# EasyEDA Pro project 51单片机串口开关V4.eprj

# Schematic Schematic1
Create Date: 2023-08-01; Page Name: P1; Project Name: 51单片机串口开关V4; Schematic Name: Schematic1; Update Date: 2024-06-24; Company: 嘉立创EDA; Page Size: A4; Version: V1.0
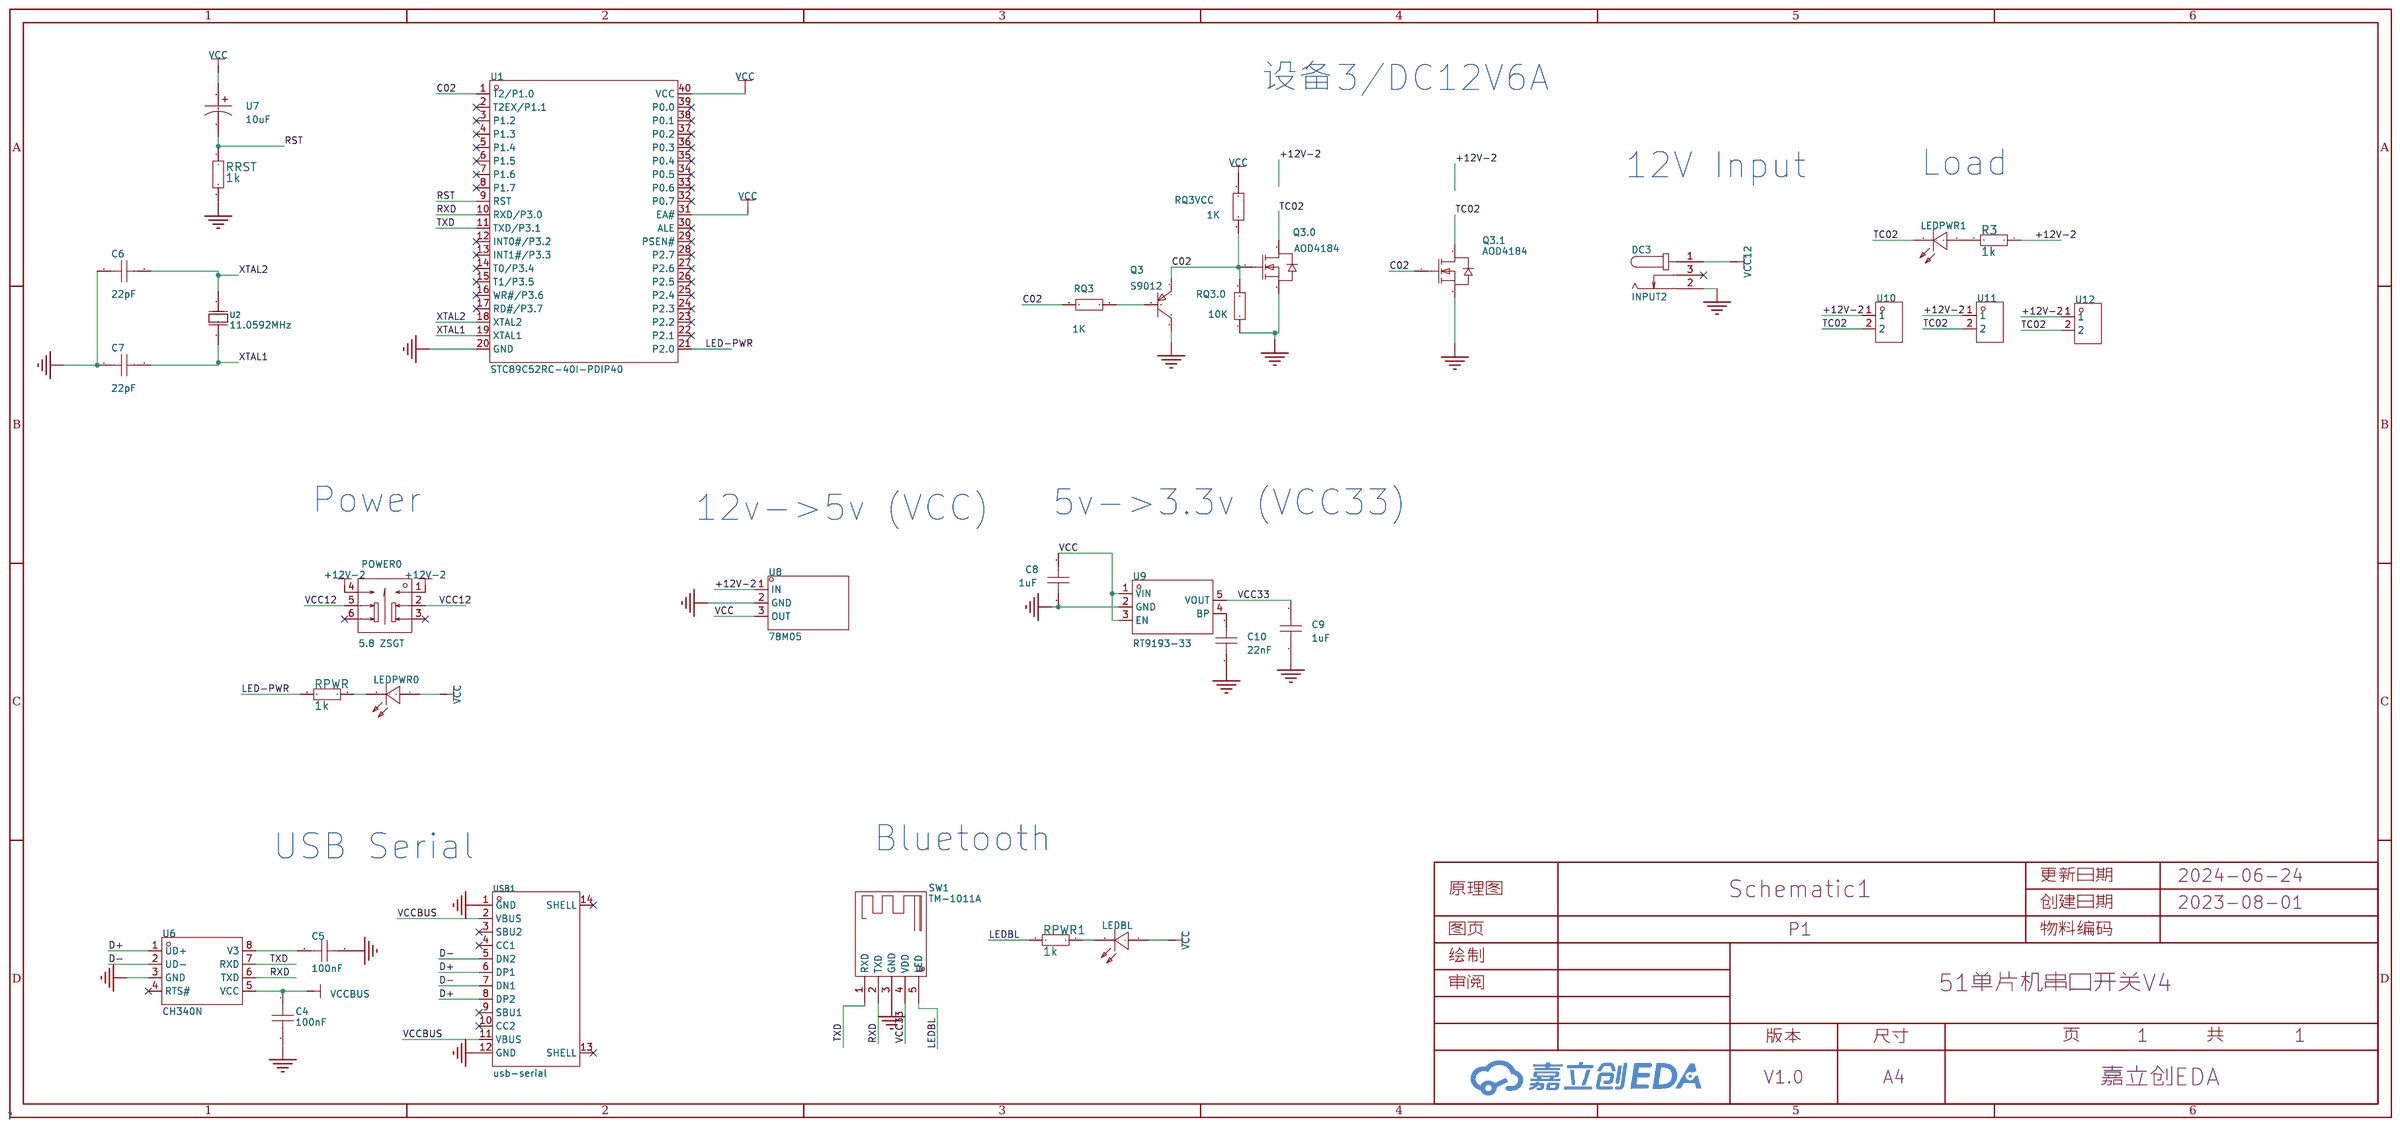
[diagram p0: schematic sheet]

## Parts
C4  100nF  [C0603]
C5  100nF  [C0603]
C6  22pF  [CAP-TH_L5.8-W2.4-P2.54-D0.6]
C7  22pF  [CAP-TH_L5.8-W2.4-P2.54-D0.6]
C8  1uF  [C0603]
C9  1uF  [C0603]
C10  22nF  [C0603]
DC3  INPUT2  [DC-IN-TH_DC-005-20A]
LEDBL  Φ3mm直插蓝色发光二极管  [LED-TH_BD4.1-P2.50-D0.5-FD_BULE]
LEDPWR0  Φ3mm直插蓝色发光二极管  [LED-TH_BD4.1-P2.50-D0.5-FD_BULE]
LEDPWR1  Φ3mm直插蓝色发光二极管  [LED-TH_BD4.1-P2.50-D0.5-FD_BULE]
POWER0  5.8 ZSGT  [SW-TH_5.8ZSGT]
Q3  S9012  [TO-92-3_L4.6-W3.6-P1.27-L-1]
Q3.0  AOD4184  [TO-252-2_L6.6-W6.1-P4.58-LS9.9-BR]
Q3.1  AOD4184  [TO-252-2_L6.6-W6.1-P4.58-LS9.9-BR]
R3  1k  [0603]
RPWR  1k  [0603]
RPWR1  1k  [0603]
RQ3  1K  [R0603]
RQ3.0  10K  [R0603]
RQ3VCC  1K  [R0603]
RRST  1k  [0603]
SW1  TM-1011A  [SW-SMD_TM-1011A]
U1  STC89C52RC-40I-PDIP40  [DIP-40_L52.0-W13.7-P2.54-LS15.2-BL]
U2  11.0592MHz  [CRYSTAL-TH_L10.8-W4.5-P4.88]
U6  CH340N  [SOP-8_L4.9-W3.9-P1.27-LS6.0-BL]
U7  10uF  [CAP-TH_BD6.3-P2.50-D0.5-FD]
U8  78M05  [TO-252-2_L6.6-W6.1-P4.57-LS9.9-BR-CW]
U9  RT9193-33  [SOT-23-5_L2.9-W1.6-P0.95-LS2.8-BL]
U10  HX 2.54mm-2P ZZ-MS  [CONN-TH_2P-P2.50_HX-2.54MM-2P-ZZ-MS]
U11  HX 2.54mm-2P ZZ-MS  [CONN-TH_2P-P2.50_HX-2.54MM-2P-ZZ-MS]
U12  HX 2.54mm-2P ZZ-MS  [CONN-TH_2P-P2.50_HX-2.54MM-2P-ZZ-MS]
USB1  usb-serial  [USB-C-SMD_TYPE-C-6PIN-2MD-073]

## Library data of the parts
C4 C5 C8-C10 = CAP_0603: Supplier Footprint: 0603
C6 C7 = CC1H220KA1EDCH4B1100: 容值:22pF;精度:±10%;额定电压:50V;温度系数:NP0;; LCSC Part Name: 22pF ±10% 50V; Supplier Part: C2832510; Manufacturer: Dersonic(德尔创); Supplier Footprint: 插件,P=2.54mm; JLCPCB Part Class: 扩展库; Datasheet: https://atta.szlcsc.com/upload/public/pdf/source/20211103/062C09467AB58979163D97626BAD0297.pdf; Supplier: LCSC; Tolerance: ±10%; Voltage Rated: 50V; Lead Spacing: 2.54mm; Temperature Coefficient: NP0; φD: 4.8mm; Body Thickness: 2.4mm
DC3 = DC-005-20A_C136744: 触点内径:2mm;触点外径:6.4mm;额定电流:500mA;额定电压:30V;; LCSC Part Name: DC-005-20A  内芯2.0mm 全铜; Supplier Part: C136744; Manufacturer: 韩国韩荣; Manufacturer Part: DC-005-20A; Supplier Footprint: 插件; JLCPCB Part Class: 扩展库; Datasheet: https://atta.szlcsc.com/upload/public/pdf/source/20210810/D1FE451D887B1804F0660F580C4AD849.pdf; Supplier: LCSC; Inside Contact Diameter: 2mm; Outside Contact Diameter: 6.4mm; Current Rating (Max): 500mA; Voltage Rating (Max): 30V
LEDBL LEDPWR0 LEDPWR1 = Φ3mm直插蓝色发光二极管: Supplier Part: C9900011188; Supplier Footprint: LED-TH; JLCPCB Part Class: 扩展库; Datasheet: https://atta.szlcsc.comnull; Supplier: LCSC
POWER0 = 5.8 ZSGT: 触点电流:110mA;额定电压 (DC):30V;绝缘电阻:100MΩ;电路结构:双刀双掷;安装方式:直插;自锁/无锁:自锁;按键形状:方形按钮;按键/盖帽颜色:白色;带灯:无;引脚样式:PC引脚;作用力:150gf@±50gf;工作温度:-10℃~+70℃;机械寿命:100000;; LCSC Part Name: 5.8*5.8有头/高头 带锁/自锁开关 泡泡机开关; Supplier Part: C2681587; Manufacturer: SHOU HAN(首韩); Supplier Footprint: 插件; Datasheet: https://atta.szlcsc.com/upload/public/pdf/source/20210107/C2681587_CDDDDA4A1C7AC9FEB01815B75893A6BA.pdf; Supplier: LCSC; Contact Current: 110mA; Voltage Rating (DC): 30V; Insulation Resistance: 100MΩ; Circuit: 双刀双掷; Mounting Style: 直插; Self Lock / No Lock: 自锁; Actuator Style: 方形按钮; Actuator/Cap Color: 白色; With Lamp: 无; Pin Style: PC引脚; Operating Force: 150gf@±50gf; Operating Temperature: -10℃~+70℃; Mechanical Life: 100000
Q3 = S9012_C2931496: Supplier Part: C2931496; Manufacturer: JSMSEMI(杰盛微); Supplier Footprint: TO-92-3; JLCPCB Part Class: 扩展库; Datasheet: https://atta.szlcsc.com/upload/public/pdf/source/20211216/8B1045EB70E9342E1C247EF466AD93DE.pdf; Supplier: LCSC
Q3.0 Q3.1 = AOD4184: 类型:N沟道;漏源电压(Vdss):40V;连续漏极电流(Id):85A;功率(Pd):-;导通电阻(RDS(on)@Vgs,Id):5mΩ@10V,85A;阈值电压(Vgs(th)@Id):-;栅极电荷(Qg@Vgs):-;输入电容(Ciss@Vds):-;反向传输电容(Crss@Vds):-;; LCSC Part Name: N沟道 40V 85A; Supplier Part: C879026; Manufacturer: VBsemi(微碧); Supplier Footprint: TO-252; JLCPCB Part Class: 扩展库; Datasheet: https://atta.szlcsc.com/upload/public/pdf/source/20200930/C879026_1C5ED3CC2E280C7EDEB6515D52B7B7F3.pdf; Supplier: LCSC; Type: N沟道; Drain Source Voltage (Vdss): 40V; Continuous Drain Current (Id): 85A; Drain Source On Resistance (RDS(on)@Vgs,Id): 5mΩ@10V,85A
R3 RPWR RPWR1 RRST = 1k: Resistor; Origin Footprint 2: RES-0805; Origin Footprint 4: RES-1206; Origin Footprint 5: RES-1210; Origin Footprint 6: RES-1812; Origin Footprint 7: RES-2512; Origin Footprint 8: RES-0.25W-6.5X2.5-10.16-0.6; Origin Footprint 9: RES-0.5W-10.0X3.5-12.7-1; Origin Footprint 10: RES-1W-12.0X5.0-15.24-1; Origin Footprint 11: RES-2W-16.0X5.5-20.32-1; Origin Footprint 12: RES-3W-17.0X6.5-22.86-1; Origin Footprint 13: RES-5W-22.0X10.0-30.48-1; Design Item ID: RES; Library Name: General
RQ3 RQ3.0 RQ3VCC = Res_0603: Supplier Footprint: 0603
SW1 = 邮票5孔蓝牙模块: 6328A低成本蓝牙模块; LCSC Part Name: 蓝牙音响波轮开关 3挡拨轮开关; Supplier Part: C318960; Manufacturer: XKB Connectivity(中国星坤); Supplier Footprint: SMD-10P,11.3x11.8mm; Datasheet: https://atta.szlcsc.com/upload/public/pdf/source/20211015/0F19BB59F8C8EF90A3009BEE019EE4D4.pdf; Supplier: LCSC; NAME: LED; Pin Type: Undefined
U1 = STC89C52RC-40I-PDIP40: CPU内核:51系列;CPU最大主频:-;工作电压范围:3.3V~5.5V;内部振荡器:-;外部时钟频率范围:-;程序 FLASH容量:8KB;RAM总容量:512Byte;EEPROM/数据 FLASH容量:4KB;GPIO端口数量:35;ADC(单元数/通道数/位数):-;DAC(单元数/通道数/位数):-;(E)PWM(单元数/通道数/位数):-;8位Timer数量:-;16位Timer数量:3;32位Timer数量:-;内部比较器数量:-;U(S)ART路数:1;I2C路数:-;I2S路数:-;(; LCSC Part Name: 51系列 闪存：8KB RAM：512Byte; Supplier Part: C14022; Manufacturer: STC(宏晶); Supplier Footprint: DIP-40; JLCPCB Part Class: 扩展库; Datasheet: https://atta.szlcsc.com/upload/public/pdf/source/20210104/C14022_3E6032FDBB5DBC6F971AD019A8472F5B.pdf; Supplier: LCSC; CPU Core: 51系列; Supply Voltage Range: 3.3V~5.5V; Program FLASH Size: 8KB; RAM Size: 512Byte; EEPROM/Data FLASH Size: 4KB; GPIO Ports Number: 35; 16Bit Timer Number: 3; U(S)ART Number: 1; Peripherals / Functions / Protocol Stacks: 看门狗; Operating Temperature Range: -40℃~+85℃
U2 = ATS100B-E: 频率:10MHz;频率公差:±30ppm;负载电容:18pF;; LCSC Part Name: 10MHz ±30ppm 18pF; Supplier Part: C1669693; Manufacturer: CTS(西迪斯); Supplier Footprint: HC-49S; JLCPCB Part Class: 扩展库; Datasheet: https://atta.szlcsc.com/upload/public/pdf/source/20220124/B9986DAB42ECDE31CA8A9C6A4A6F535C.pdf; Supplier: LCSC; Frequency Tolerance: ±30ppm; Frequency Stability: ±50ppm; Load Capacitance: 18pF; Equivalent Series Resistance (ESR): 60Ω; Operating Temperature: -40℃~+85℃
U6 = CH340N: LCSC Part Name: USB转串口芯片 CH340; Supplier Part: C2977777; Manufacturer: WCH(南京沁恒); Supplier Footprint: SOP-8; Datasheet: https://atta.szlcsc.com/upload/public/pdf/source/20220223/82A45E4FF89B3EDCAD50B354450A7EF4.pdf; Supplier: LCSC
U7 = ESK106M1HD11RRSNP-R: 容值:10uF;精度:±20%;额定电压:50V;纹波电流:-;等效串联电阻:-;; LCSC Part Name: 10uF ±20% 50V; Supplier Part: C3015490; Manufacturer: MAN YUE(万裕科技); Supplier Footprint: 插件; JLCPCB Part Class: 扩展库; Datasheet: https://atta.szlcsc.com/upload/public/pdf/source/20190724/C406799_CDF11B2185D3B9C175922EABD678815E.pdf; Supplier: LCSC; Tolerance: ±20%; Rated Voltage: 50V; φD: 5mm; L: 11mm
U8 = 78M05_C347278: 输出类型:固定;最大输入电压:35V;输出电压:5V;最大输出电流:1A;电源纹波抑制比(PSRR):80dB@(120Hz);输出极性:正极;; LCSC Part Name: 输入35V 输出5V; Supplier Part: C347278; Manufacturer: UMW(友台半导体); Supplier Footprint: TO-252-2; JLCPCB Part Class: 扩展库; Datasheet: https://atta.szlcsc.com/upload/public/pdf/source/20231109/09A4DFE6E3B1A93D7EDF0732340089EB.pdf; Supplier: LCSC; Output Type: 固定; Maximum Input Voltage: 35V; Output Voltage: 5V; MAX Output Current: 1A; Power Supply Rejection Ratio (PSRR): 80dB@(120Hz); Dropout Voltage: 2V@(500mA); standby current: 6mA; Operating Temperature: -20℃~+85℃; Output Polarity: 正极; Number of Outputs: 1
U9 = RT9193-33: Supplier Part: C9900015455; Supplier Footprint: SOT-23-5; JLCPCB Part Class: 扩展库; Supplier: LCSC
U10-U12 = HX 2.54mm-2P ZZ-MS: 插针结构:1x2P;间距:2.5mm;安装方式:直插;参考系列:XH;总PIN数:2P;排数:1;每排PIN数:2;额定电流:3A;工作温度范围:-25℃~+85℃;; Supplier Part: C7543455; Manufacturer: hanxia(韩下); Supplier Footprint: 插件,P=2.5mm; JLCPCB Part Class: 扩展库; Datasheet: https://atta.szlcsc.com/upload/public/pdf/source/20230822/6A69E3B87843D2613A2AC61C827FD42E.pdf; Supplier: LCSC; Pins Structure: 1x2P; Pitch: 2.5mm; Mounting Style: 直插; Reference Series: XH; Number of Pins: 2P; Number of Rows: 1; Number of PINs Per Row: 2; Current Rating (Max): 3A; Operating Temperature Range: -25℃~+85℃
USB1 = TYPE-C 16PIN 2MD(073): 连接器类型:Type-C;标准:-;公母:母座;触点数量:16;端口数量:1;安装方式:卧贴;额定电流 - 电源:5A;工作温度范围:-25℃~+85℃;; LCSC Part Name: TYPE-C母座 16P 4脚插件带定位柱 不锈钢外壳 2次模顶; Supplier Part: C2765186; Manufacturer: SHOU HAN(首韩); Supplier Footprint: SMD; Supplier: LCSC; Connector Type: Type-C; Gender: 母座; Number of Contacts: 16; Number of Ports: 1; Mounting Style: 卧贴; Current Rating - Power (Max): 5A; Operating Temperature Range: -25℃~+85℃

## Nets
+12V-2: POWER0.1 POWER0.4 R3.1 U8.1(IN) U10.1 U11.1 U12.1
GND: C4.2 C5.2 C6.1 C7.1 C8.2 C9.1 C10.1 DC3.2 Q3.3(C) Q3.0.3(S) Q3.1.3(S) RQ3.0.1 RRST.2 SW1.3(GND) U1.20(GND) U6.3(GND) U8.2(GND) U9.2(GND) USB1.1(GND) USB1.12(GND)
VCC: C8.1 LEDBL.1(+) LEDPWR0.1(+) RQ3VCC.2 U1.31(EA#) U1.40(VCC) U7.1 U8.3(OUT) U9.1(VIN) U9.3(EN)
VCC12: DC3.1 POWER0.2 POWER0.5
VCC33: C9.2 SW1.4(VDD) U9.5(VOUT)
VCCBUS: C4.1 U6.5(VCC) USB1.2(VBUS) USB1.11(VBUS)
C02: Q3.1(E) Q3.0.1(G) Q3.1.1(G) RQ3.2 RQ3.0.2 RQ3VCC.1 U1.1(T2/P1.0)
D+: U6.1(UD+) USB1.6(DP1) USB1.8(DP2)
D-: U6.2(UD-) USB1.5(DN2) USB1.7(DN1)
LED-PWR: RPWR.2 U1.21(P2.0)
LEDBL: RPWR1.2 SW1.5(LED)
RST: RRST.1 U1.9(RST) U7.2
RXD: SW1.2(TXD) U1.10(RXD/P3.0) U6.6(TXD)
TC02: LEDPWR1.2(-) Q3.0.2(D) Q3.1.2(D) U10.2 U11.2 U12.2
TXD: SW1.1(RXD) U1.11(TXD/P3.1) U6.7(RXD)
XTAL1: C7.2 U1.19(XTAL1) U2.2
XTAL2: C6.2 U1.18(XTAL2) U2.1
$1N2137: C5.1 U6.8(V3)
$1N11558: LEDPWR0.2(-) RPWR.1
$1N30605: Q3.2(B) RQ3.1
$1N35414: C10.2 U9.4(BP)
$1N36713: LEDBL.2(-) RPWR1.1
$1N40060: LEDPWR1.1(+) R3.2

Not connected (* = marked no-connect by the designer): DC3 3*; POWER0 3* 6*; U1 2(T2EX/P1.1)* 3(P1.2)* 4(P1.3)* 5(P1.4)* 6(P1.5)* 7(P1.6)* 8(P1.7)* 12(INT0#/P3.2)* 13(INT1#/P3.3)* 14(T0/P3.4)* 15(T1/P3.5)* 16(WR#/P3.6)* 17(RD#/P3.7)* 22(P2.1)* 23(P2.2)* 24(P2.3)* 25(P2.4)* 26(P2.5)* 27(P2.6)* 28(P2.7)* 29(PSEN#)* 30(ALE)* 32(P0.7)* 33(P0.6)* 34(P0.5)* 35(P0.4)* 36(P0.3)* 37(P0.2)* 38(P0.1)* 39(P0.0)*; U6 4(RTS#)*; USB1 3(SBU2)* 4(CC1)* 9(SBU1)* 10(CC2)* 13(SHELL)* 14(SHELL)*

## Notes on the sheet
- 设备3/DC12V6A
- 12V Input
- Load
- Power
- 12v->5v (VCC)
- 5v->3.3v (VCC33)
- Bluetooth
- USB Serial

# Board PCB1
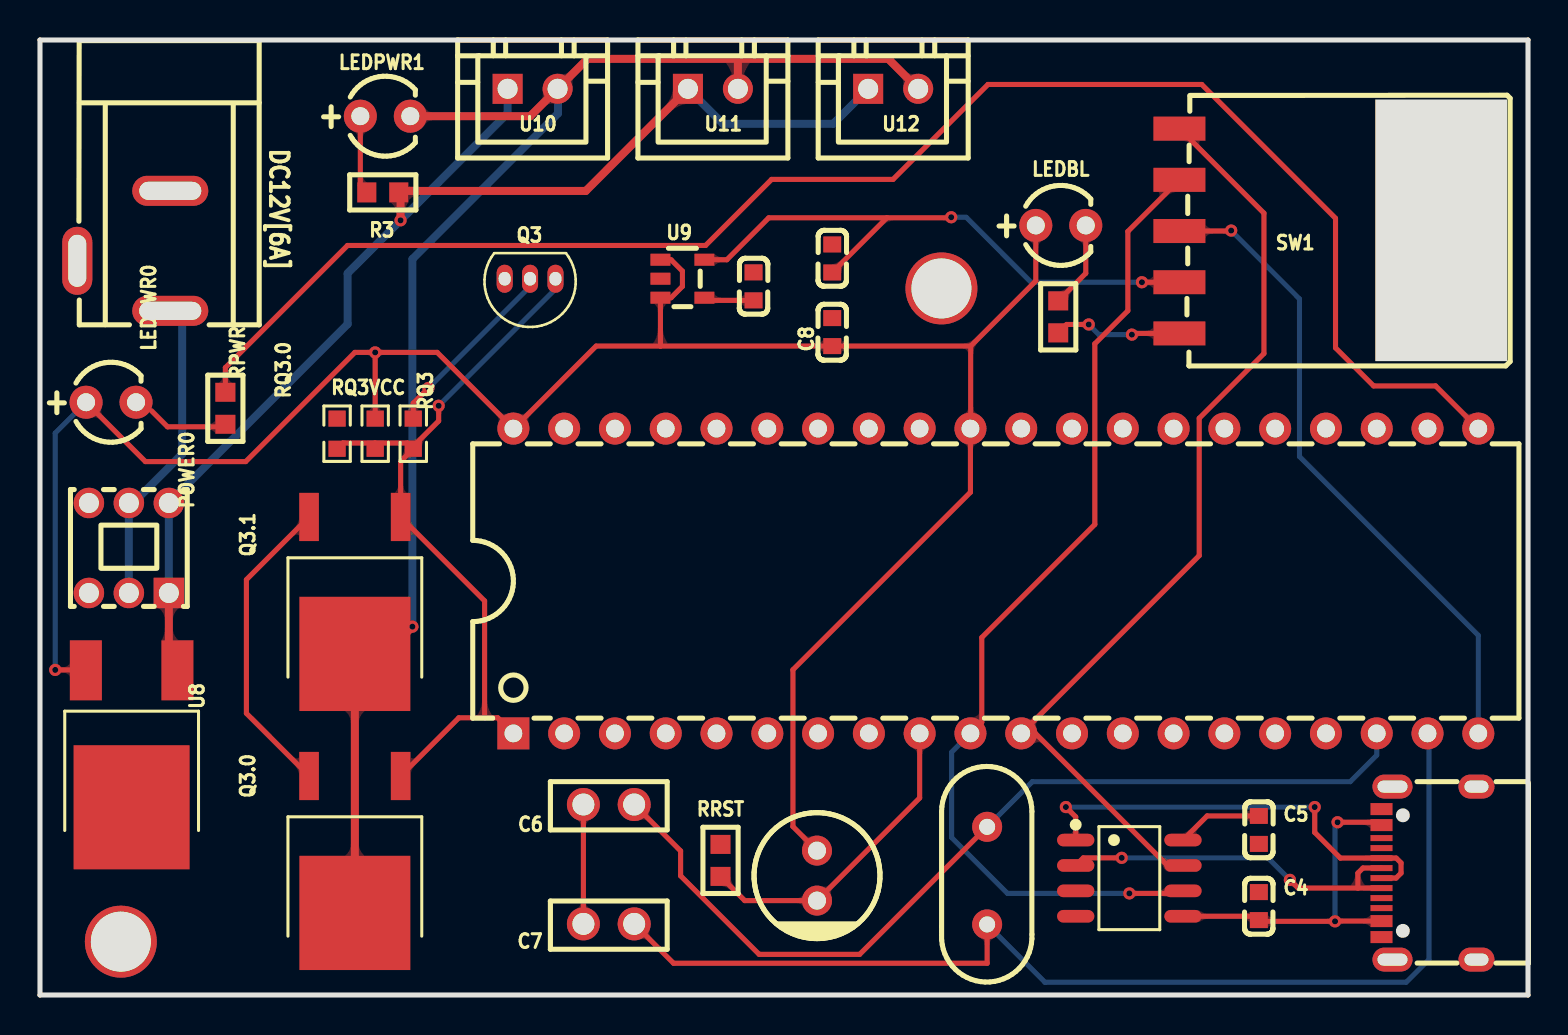
[diagram p1: board, top side]
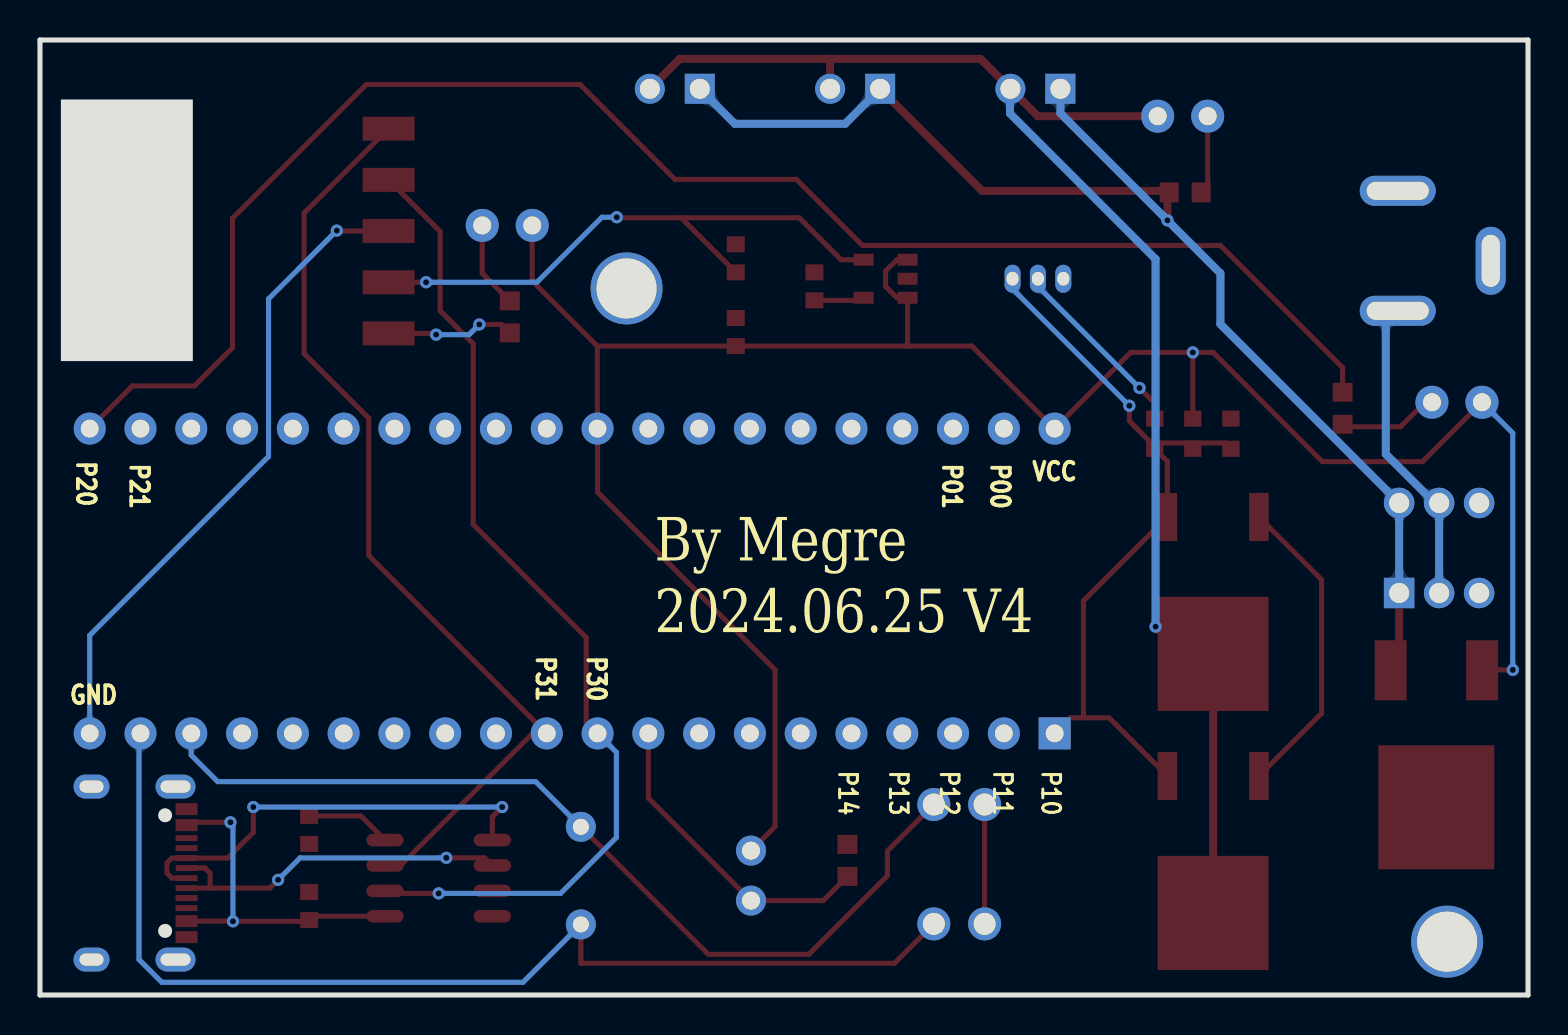
[diagram p2: board, bottom side, seen from below]

Outline 74.42 x 47.75 mm; copper layers: Top Layer, Bottom Layer. Coordinates in mm from the lower left corner of the outline.
Outline path: 0,47.75 74.42,47.75 74.42,0 0,0 0,47.75
Stack: Top Layer 0.035mm / Dielectric1 1.51mm FR4 er 4.5 / Bottom Layer 0.035mm

## Design rules (mm)
template: JLCPCB Capability(Two Layers Board)
spacing copperThickness1oz (default): track to track 0.102, other pairs 0.152 to 0.3
spacing copperThickness2oz: track to track 0.203, other pairs 0.152 to 0.3
track width copperThickness1oz (default): min 0.127, default 0.254, max 2.54
track width copperThickness2oz: min 0.203, default 0.254, max 2.54
differential pair differentialPair (default): width min 0.127, default 0.254, max 2.54; gap min 0.152, default 0.152
via viaSize (default): diameter min 0.5, default 0.61, max 10; hole min 0.3, default 0.305, max 6.3

## Placement (name value [footprint] x y rotation side)
C4  100nF  [C0603]  60.96 4.45 90 top
C5  100nF  [C0603]  60.96 8.26 270 top
C6  22pF  [CAP-TH_L5.8-W2.4-P2.54-D0.6]  28.45 9.53 0 top
C7  22pF  [CAP-TH_L5.8-W2.4-P2.54-D0.6]  28.45 3.56 0 top
C8  1uF  [C0603]  39.62 33.15 90 top
C9  1uF  [C0603]  39.62 36.83 270 top
C10  22nF  [C0603]  35.69 35.43 270 top
DC3  INPUT2  [DC-IN-TH_DC-005-20A]  4.19 37.21 270 top
LEDBL  Φ3mm直插蓝色发光二极管  [LED-TH_BD4.1-P2.50-D0.5-FD_BULE]  51.05 38.48 0 top
LEDPWR0  Φ3mm直插蓝色发光二极管  [LED-TH_BD4.1-P2.50-D0.5-FD_BULE]  3.55 29.64 0 top
LEDPWR1  Φ3mm直插蓝色发光二极管  [LED-TH_BD4.1-P2.50-D0.5-FD_BULE]  17.27 43.94 0 top
NOREF  -  [Pad_e17232]  4.04 2.67 0 top
NOREF#2  -  [Pad_e17230]  45.08 35.33 0 top
POWER0  5.8 ZSGT  [SW-TH_5.8ZSGT]  4.44 22.35 0 top
Q3  S9012  [TO-92-3_L4.6-W3.6-P1.27-L-1]  24.51 35.81 180 top
Q3.0  AOD4184  [TO-252-2_L6.6-W6.1-P4.58-LS9.9-BR]  15.75 7.53 90 top
Q3.1  AOD4184  [TO-252-2_L6.6-W6.1-P4.58-LS9.9-BR]  15.75 20.48 90 top
R3  1k  [0603]  17.14 40.13 180 top
RPWR  1k  [0603]  9.27 29.34 90 top
RPWR1  1k  [0603]  50.93 33.91 270 top
RQ3  1K  [R0603]  18.67 28.07 270 top
RQ3.0  10K  [R0603]  14.86 28.07 270 top
RQ3VCC  1K  [R0603]  16.76 28.07 90 top
RRST  1k  [0603]  34.04 6.73 90 top
SW1  TM-1011A  [SW-SMD_TM-1011A]  56.39 39.37 270 top
U1  STC89C52RC-40I-PDIP40  [DIP-40_L52.0-W13.7-P2.54-LS15.2-BL]  47.81 20.7 0 top
U2  11.0592MHz  [CRYSTAL-TH_L10.8-W4.5-P4.88]  47.37 5.97 270 top
U6  CH340N  [SOP-8_L4.9-W3.9-P1.27-LS6.0-BL]  54.48 5.84 270 top
U7  10uF  [CAP-TH_BD6.3-P2.50-D0.5-FD]  38.86 5.97 270 top
U8  78M05  [TO-252-2_L6.6-W6.1-P4.57-LS9.9-BR-CW]  4.58 12.81 90 top
U9  RT9193-33  [SOT-23-5_L2.9-W1.6-P0.95-LS2.8-BL]  32.13 35.81 270 top
U10  HX 2.54mm-2P ZZ-MS  [CONN-TH_2P-P2.50_HX-2.54MM-2P-ZZ-MS]  24.64 45.31 0 top
U11  HX 2.54mm-2P ZZ-MS  [CONN-TH_2P-P2.50_HX-2.54MM-2P-ZZ-MS]  33.65 45.31 0 top
U12  HX 2.54mm-2P ZZ-MS  [CONN-TH_2P-P2.50_HX-2.54MM-2P-ZZ-MS]  42.67 45.31 0 top
USB1  usb-serial  [USB-C-SMD_TYPE-C-6PIN-2MD-073]  69.47 6.1 90 top

## Footprints (pads in the part's own frame, mm; a bottom-side part is the same pattern mirrored in y, then rotated)
0603
  rect 0.95x1 smd: 1(-0.8,0) 2(0.8,0)
C0603
  rect 0.8x0.9 smd: 1(-0.7,0) 2(0.7,0)
CAP-TH_BD6.3-P2.50-D0.5-FD
  round 1.5 hole 0.9: 1(-1.25,0) 2(1.25,0)
CAP-TH_L5.8-W2.4-P2.54-D0.6
  round 1.65 hole 1.1: 1(-1.27,0) 2(1.27,0)
CONN-TH_2P-P2.50_HX-2.54MM-2P-ZZ-MS
  rect 1.5x1.5 hole 1: 1(-1.25,0)
  round 1.5 hole 1: 2(1.25,0)
CRYSTAL-TH_L10.8-W4.5-P4.88
  round 1.5 hole 0.8: 1(-2.44,0) 2(2.44,0)
DC-IN-TH_DC-005-20A
  oval 1.5x3.8 hole 0.9x3.1: 1(3,2.325) 2(-3,2.325)
  oval 3.4x1.5 hole 2.6x0.9: 3(0.5,-2.325)
DIP-40_L52.0-W13.7-P2.54-LS15.2-BL
  rect 1.6x1.6 hole 0.889: 1(-24.13,-7.62)
  round 1.6 hole 0.889: 2(-21.59,-7.62) 3(-19.05,-7.62) 4(-16.51,-7.62) 5(-13.97,-7.62) 6(-11.43,-7.62) 7(-8.89,-7.62) 8(-6.35,-7.62) 9(-3.81,-7.62) 10(-1.27,-7.62) 11(1.27,-7.62) 12(3.81,-7.62) 13(6.35,-7.62) 14(8.89,-7.62) 15(11.43,-7.62) 16(13.97,-7.62) 17(16.51,-7.62) 18(19.05,-7.62) 19(21.59,-7.62) 20(24.13,-7.62) 21(24.13,7.62) 22(21.59,7.62) 23(19.05,7.62) 24(16.51,7.62) 25(13.97,7.62) 26(11.43,7.62) 27(8.89,7.62) 28(6.35,7.62) 29(3.81,7.62) 30(1.27,7.62) 31(-1.27,7.62) 32(-3.81,7.62) 33(-6.35,7.62) 34(-8.89,7.62) 35(-11.43,7.62) 36(-13.97,7.62) 37(-16.51,7.62) 38(-19.05,7.62) 39(-21.59,7.62) 40(-24.13,7.62)
LED-TH_BD4.1-P2.50-D0.5-FD_BULE
  round 1.651 hole 0.9: 1(-1.25,0) 2(1.25,0)
Pad_e17230
  round 3.6 hole 3: 41(0,0)
Pad_e17232
  round 3.6 hole 3: 41(0,0)
R0603
  rect 0.806x0.864 smd: 1(-0.753,0) 2(0.753,0)
SOP-8_L4.9-W3.9-P1.27-LS6.0-BL
  oval 0.63x1.865 smd: 1(-1.905,-2.683) 2(-0.635,-2.683) 3(0.635,-2.683) 4(1.905,-2.683) 5(1.905,2.683) 6(0.635,2.683) 7(-0.635,2.683) 8(-1.905,2.683)
SOT-23-5_L2.9-W1.6-P0.95-LS2.8-BL
  rect 0.6x1 smd: 1(-0.95,-1.1) 2(0,-1.1) 3(0.95,-1.1) 4(0.95,1.1) 5(-0.95,1.1)
SW-SMD_TM-1011A
  rect 1.2x2.6 smd: 1(-3.95,0.6) 2(-1.39,0.6) 3(1.17,0.6) 4(3.73,0.6) 5(6.29,0.6)
SW-TH_5.8ZSGT
  rect 1.524x1.524 hole 1: 1(2,-2.25)
  round 1.524 hole 1: 2(0,-2.25) 3(-2,-2.25) 4(2,2.25) 5(0,2.25) 6(-2,2.25)
TO-92-3_L4.6-W3.6-P1.27-L-1
  oval 0.8x1.4 hole 0.6x0.682: 1(-1.27,0) 2(0,0) 3(1.27,0)
TO-252-2_L6.6-W6.1-P4.57-LS9.9-BR-CW
  rect 3x1.6 smd: 1(3.424,-2.29) 3(3.424,2.29)
  rect 6.2x5.8 smd: 2(-3.424,0)
TO-252-2_L6.6-W6.1-P4.58-LS9.9-BR
  rect 2.409x0.979 smd: 1(3.424,-2.29) 3(3.424,2.29)
  rect 5.711x5.548 smd: 2(-3.424,0)
USB-C-SMD_TYPE-C-6PIN-2MD-073
  rect 0.6x1.1 smd: 1(-3.2,2.375) 2(-2.4,2.375) 11(2.4,2.375) 12(3.2,2.375)
  rect 0.3x1.1 smd: 3(-1.75,2.375) 4(-1.25,2.375) 5(-0.75,2.375) 6(-0.25,2.375) 7(0.25,2.375) 8(0.75,2.375) 9(1.25,2.375) 10(1.75,2.375)
  oval 1.2x2 hole 0.6x1.5: 13(-4.325,1.825) 14(4.325,1.825)
  oval 1.2x1.8 hole 0.6x1.2: 13(-4.325,-2.375) 14(4.325,-2.375)

## Nets
As in the schematic.

Pads without a net: DC3 3; NOREF 41; NOREF#2 41; POWER0 3 6; U1 2 3 4 5 6 7 8 12 13 14 15 16 17 22 23 24 25 26 27 28 29 30 32 33 34 35 36 37 38 39; U6 4; USB1 3 4 9 10 13 14

## Via types
v1: diameter 0.61, hole 0.305, Top Layer to Bottom Layer, 18 vias

## Routing (per net, layer and track width the routed paths; a pad name or vN(x,y) marks a point on that pad's centre or on a via; arc(x,y) is an arc through that point)
+12V-2: length 64.9
  Top Layer w0.4: v1(18.03,38.73) 18.03,40.04 R3.1 17.87,40.2 27.3,40.2 U11.1 ; U8.1 6.44,16.66 POWER0.1
  Bottom Layer w0.4: U11.1 34.16,43.56 39.67,43.56 U12.1 ; POWER0.1 POWER0.4 6.44,24.61 15.39,33.55 15.39,36.09 v1(18.03,38.73) 23.39,44.09 U10.1
GND: length 54.4
  Top Layer w0.254: SW1.3 59.55,38.2 v1(59.58,38.22) ; Q3.0.3 10.32,14.09 10.32,20.77 Q3.1.3 ; 27.18,9.53 27.18,3.56
  Bottom Layer w0.254: U1.20 71.94,17.98 62.99,26.92 62.99,34.81 v1(59.58,38.22)
VCC: length 112.6
  Top Layer w0.254: U7.1 37.66,8.42 37.66,16.26 46.54,25.14 U1.31 46.55,28.33 46.55,32.45 ; U8.3 2.27,16.26 v1(0.76,16.26) ; U9.1 31.56,36.76 32.13,36.2 32.13,35.43 31.56,34.86 U9.3 31.03,32.45 ; v1(16.76,32.13) RQ3VCC.2 ; v1(16.76,32.13) 15.75,32.13 10.29,26.67 5.27,26.67 2.3,29.64 ; v1(16.76,32.13) 19.87,32.13 U1.40 23.69,28.32 27.81,32.45 31.03,32.45 ; 46.55,32.45 C8.1 31.03,32.45 ; 46.55,32.45 49.8,35.7 LEDBL.1
  Bottom Layer w0.254: v1(0.76,16.26) 0.76,28.1 2.3,29.64 ; 23.62,28.32 U1.40
VCC12: length 15.6
  Bottom Layer w0.4: DC3.1 7.11,33.62 7.11,27.05 4.66,24.6 POWER0.5 POWER0.2
VCC33: length 29.8
  Top Layer w0.254: v1(45.57,38.89) 45.55,38.86 42.36,38.86 ; 42.36,38.86 36.45,38.86 34.35,36.76 U9.5 ; 42.36,38.86 C9.2 ; v1(55.11,35.64) SW1.4
  Bottom Layer w0.254: v1(55.11,35.64) 49.57,35.64 46.32,38.89 v1(45.57,38.89)
VCCBUS: length 17.3
  Top Layer w0.254: USB1.2 64.78,3.7 v1(64.77,3.68) 61.02,3.68 C4.1 60.77,3.94 U6.5 ; USB1.11 66.95,8.64 v1(64.9,8.64)
  Bottom Layer w0.254: v1(64.9,8.64) 64.77,8.51 v1(64.77,3.68)
C02: length 38.5
  Top Layer w0.254: RQ3.0.2 15.15,27.6 16.76,27.6 ; 22.24,13.86 20.95,13.86 Q3.0.1 ; 22.24,13.86 22.24,19.7 Q3.1.1 18.04,26.68 RQ3.2 18.61,27.37 ; 22.24,13.86 22.9,13.86 U1.1 ; 18.54,27.31 18.61,27.37 ; 18.61,27.37 18.38,27.6 16.76,27.6 ; 18.61,27.37 19.94,28.7 v1(19.94,29.46) ; RQ3VCC.1 16.76,27.6
  Bottom Layer w0.254: v1(19.94,29.46) 25.78,35.31 Q3.1
D+: length 22.1
  Top Layer w0.254: v1(63.75,9.4) 63.75,8.13 65.04,6.85 USB1.8 67.83,6.85 68.07,6.6 68.07,6.1 67.82,5.85 USB1.6 ; v1(51.31,9.4) 51.8,8.91 U6.1
  Bottom Layer w0.254: v1(63.75,9.4) v1(51.31,9.4)
D-: length 18.1
  Top Layer w0.254: v1(62.51,5.76) 62.92,5.35 65.91,5.35 ; v1(54.1,6.86) 52.18,6.86 U6.2 ; USB1.7 67.09,6.35 66.17,6.35 65.91,6.1 65.91,5.35 ; 65.91,5.35 USB1.5
  Bottom Layer w0.254: v1(54.1,6.86) 61.41,6.86 v1(62.51,5.76)
LED-PWR: length 80.7
  Top Layer w0.254: U1.21 69.8,30.46 66.7,30.46 64.79,32.36 64.79,38.84 58.1,45.53 47.41,45.53 42.67,40.78 36.59,40.78 33.29,37.48 15.38,37.48 9.27,31.37 RPWR.2
LEDBL: length 6.5
  Top Layer w0.254: v1(54.61,33.02) 54.67,33.08 SW1.5 ; RPWR1.2 51.35,33.53 v1(52.45,33.53)
  Bottom Layer w0.254: v1(54.61,33.02) 52.96,33.02 v1(52.45,33.53)
RST: length 15.8
  Top Layer w0.254: RRST.1 35.25,4.72 U7.2 44,9.85 U1.9
RXD: length 50.4
  Top Layer w0.254: SW1.2 54.41,38.18 54.41,34.22 52.76,32.56 52.76,23.53 47.1,17.87 47.1,13.64 46.55,13.08 U1.10 ; v1(54.48,5.08) 57.04,5.08 U6.6
  Bottom Layer w0.254: v1(54.48,5.08) 48.39,5.08 45.59,7.87 45.59,12.14 U1.10
TC02: length 75
  Top Layer w0.4: 34.9,46.81 U11.2 ; 34.9,46.81 42.43,46.81 U12.2 ; 34.9,46.81 27.38,46.81 U10.2 24.52,43.94 LEDPWR1.2 ; Q3.0.2 Q3.1.2 17.26,17.06 v1(18.63,18.42)
  Bottom Layer w0.4: v1(18.63,18.42) 18.63,36.8 25.91,44.08 25.91,45.29 U10.2
TXD: length 47.8
  Top Layer w0.254: 49.09,13.08 57.98,21.97 57.98,28.84 61.21,32.07 61.21,39.09 SW1.1 ; 49.09,13.08 49.78,13.08 56.39,6.48 U6.7 ; 49.09,13.08 U1.11
XTAL1: length 55.5
  Top Layer w0.254: C7.2 31.69,1.59 47.37,1.59 U2.2
  Bottom Layer w0.254: U2.2 50.27,0.64 68.33,0.64 69.47,1.78 69.47,13.01 U1.19
XTAL2: length 46.2
  Top Layer w0.254: U2.1 40.99,2.03 35.97,2.03 32.04,5.96 32.04,7.2 C6.2
  Bottom Layer w0.254: U1.18 66.86,11.99 65.53,10.67 49.63,10.67 U2.1
$1N2137: length 4.3
  Top Layer w0.254: U6.8 58.37,8.96 C5.1
$1N11558: length 4.1
  Top Layer w0.254: RPWR.1 9.14,28.41 6.38,28.41 5.58,29.21
$1N30605: length 9.4
  Top Layer w0.254: RQ3.1 18.67,29.59 v1(19.43,30.35)
  Bottom Layer w0.254: v1(19.43,30.35) 24.51,35.43 Q3.2
$1N35414: length 2.5
  Top Layer w0.254: U9.4 33.36,34.73 C10.2
$1N36713: length 4.3
  Top Layer w0.254: LEDBL.2 52.3,36.09 RPWR1.1
$1N40060: length 3.9
  Top Layer w0.254: R3.2 16.02,40.46 LEDPWR1.1

## Copper pours and planes (outline as drawn; the poured copper is in the pictures)
GND on Top Layer: -3.05,49.78 76.2,49.78 76.2,-2.03 -3.05,-2.03

Small or netless copper shapes (teardrops, artwork), in the pictures only: 104 on Top Layer, 38 on Bottom Layer

## Text on the board
Bottom Silkscreen Layer: P10 | P11 | P12 | P13 | P14 | VCC | GND | P00 | P01 | P30 | P31 | P21 | P20 | By Megre / 2024.06.25 V4
Top Silkscreen Layer: DC12V[6A]
